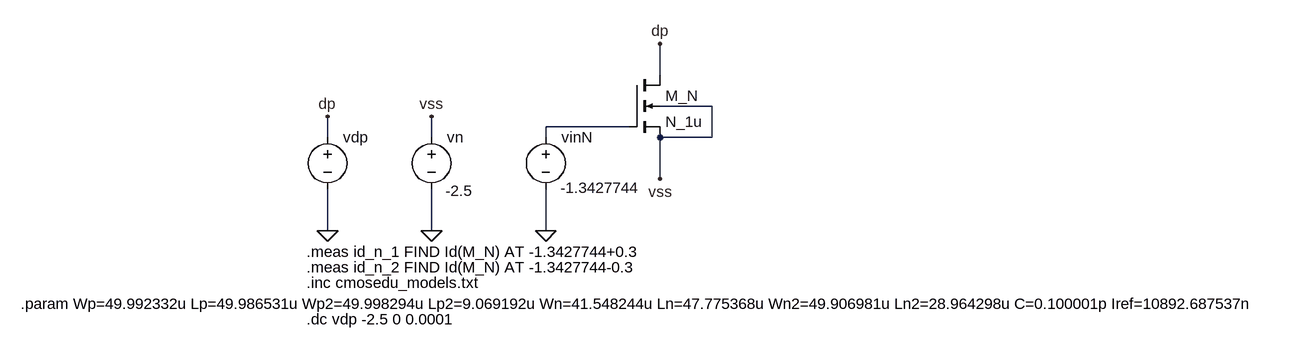
[diagram p0: schematic R4.asc]
R4.asc, the LTspice schematic file:
Version 4
SHEET 1 2140 680
WIRE 928 -112 928 -160
WIRE 1008 -64 928 -64
WIRE 880 -32 752 -32
WIRE 416 -16 416 -48
WIRE 576 -16 576 -48
WIRE 752 -16 752 -32
WIRE 1008 -16 1008 -64
WIRE 1008 -16 928 -16
WIRE 928 48 928 -16
WIRE 416 128 416 64
WIRE 576 128 576 64
WIRE 752 128 752 64
FLAG 752 128 0
FLAG 576 -48 vss
FLAG 576 128 0
FLAG 928 -160 dp
FLAG 416 128 0
FLAG 416 -48 dp
FLAG 928 48 vss
SYMBOL nmos4 880 -112 R0
SYMATTR InstName M_N
SYMATTR Value2 l={Ln} w={Wn}
SYMATTR Value N_1u
SYMBOL voltage 752 -32 R0
WINDOW 3 23 94 Left 2
WINDOW 123 0 0 Left 2
WINDOW 39 0 0 Left 2
SYMATTR Value -1.3427744
SYMATTR InstName vinN
SYMBOL voltage 576 -32 R0
WINDOW 123 0 0 Left 2
WINDOW 39 0 0 Left 2
WINDOW 3 22 98 Left 2
SYMATTR Value -2.5
SYMATTR InstName vn
SYMBOL voltage 416 -32 R0
WINDOW 123 0 0 Left 2
WINDOW 39 0 0 Left 2
WINDOW 3 25 97 Left 2
SYMATTR Value ""
SYMATTR InstName vdp
TEXT 384 208 Left 2 !.inc cmosedu_models.txt
TEXT 384 264 Left 2 !.dc vdp -2.5 0 0.0001
TEXT 384 160 Left 2 !.meas id_n_1 FIND Id(M_N) AT -1.3427744+0.3
TEXT 384 184 Left 2 !.meas id_n_2 FIND Id(M_N) AT -1.3427744-0.3
TEXT -56 240 Left 2 !.param Wp=49.992332u Lp=49.986531u Wp2=49.998294u Lp2=9.069192u Wn=41.548244u Ln=47.775368u Wn2=49.906981u Ln2=28.964298u C=0.100001p Iref=10892.687537n

The netlist it stands for:
* R4.asc
M_N dp N001 vss vss N_1u l={Ln} w={Wn}
vinN N001 0 -1.3427744
vn vss 0 -2.5
vdp dp 0
.model NMOS NMOS
.model PMOS PMOS
.lib standard.mos
.inc cmosedu_models.txt
.dc vdp -2.5 0 0.0001
.meas id_n_1 FIND Id(M_N) AT -1.3427744+0.3
.meas id_n_2 FIND Id(M_N) AT -1.3427744-0.3
.param Wp=49.992332u Lp=49.986531u Wp2=49.998294u Lp2=9.069192u Wn=41.548244u Ln=47.775368u Wn2=49.906981u Ln2=28.964298u C=0.100001p Iref=10892.687537n
.backanno
.end